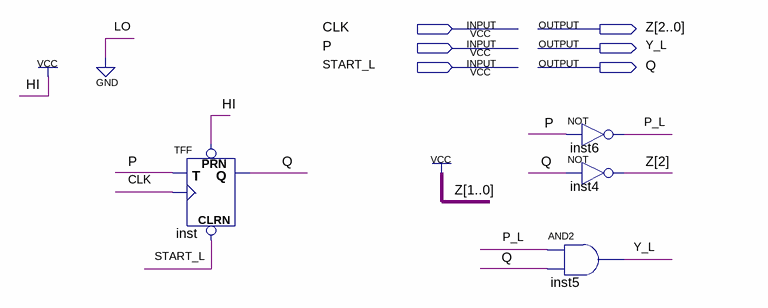
[diagram p0: schematic sheet]
// Quartus schematic Practical2.bdf as structural Verilog: 4 symbols, 6 pins
module Practical2 (
  input  CLK,
  input  P,
  input  START_L,
  output [2:0] Z,
  output Y_L,
  output Q
);

  wire P_L;

  TFF inst (.PRN(1'b1), .CLRN(START_L), .T(P), .CLK(CLK), .Q(Q));
  not inst6 (P_L, P);
  not inst4 (Z[2], Q);
  and inst5 (Y_L, P_L, Q);

  assign Z[1:0] = 2'b11;
endmodule
